# Altium schematic sheet CPLD.SchDoc: {Наименование}
size 420 x 297 mm; DocumentNumber: НРДЦ.ХХХХХХ.ХХХ ХХ; SheetNumber: {}; SheetTotal: {}; PageSetup: Record=PageOptions|CenterHorizontal=False|CenterVertical=False|PrintScale=0.95|XCorrection=0.00|YCorrection=0.00|PrintKind=1|BorderSize=5000000|LeftOffset=0|BottomOffset=0|Orientation=1|PaperLength=1000|PaperWidth=1000|Scale=100|PaperSource=15|PrintQuality=600|MediaType=1|DitherType=10|PaperKind=A4|PrintScaleMode=1; Rule: PcbType=ProtelPcb
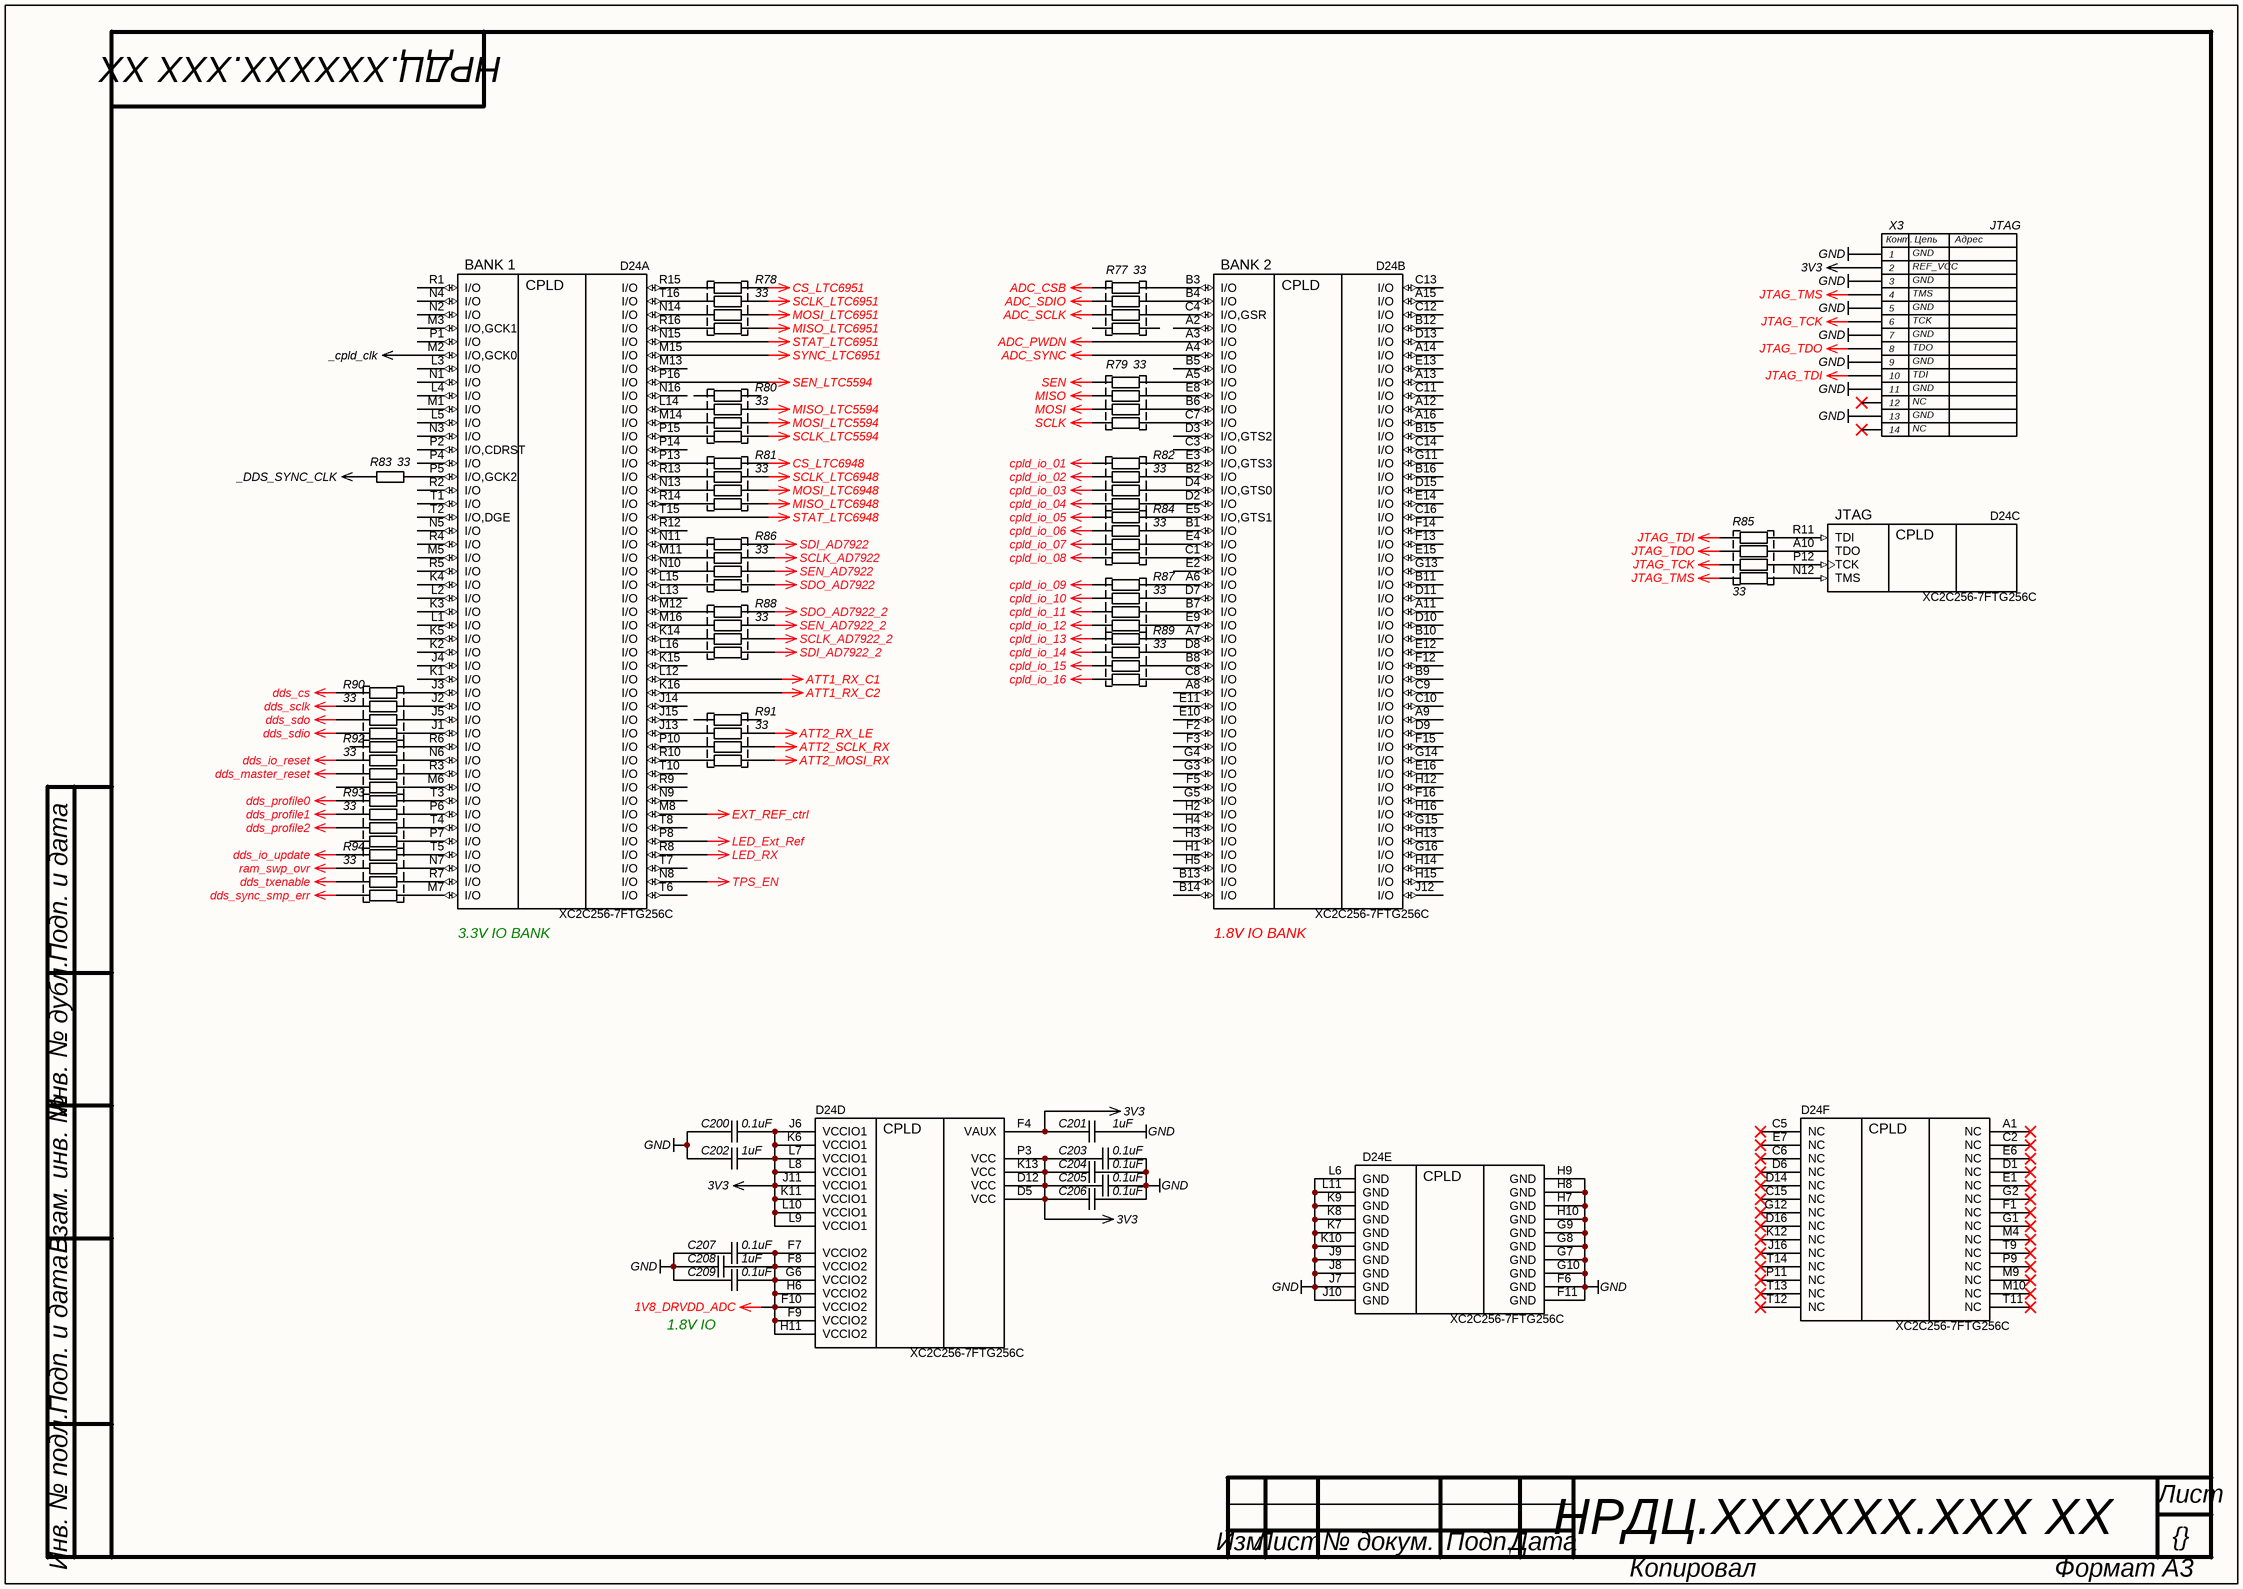
[diagram p0: CPLD.SchDoc]

## Parts
C200  value 0.1uF  [C0402]  (hidden comment: CAP)
C201  value 1uF  [C0402]  (hidden comment: CAP)
C202  value 1uF  [C0402]  (hidden comment: CAP)
C203  value 0.1uF  [C0402]  (hidden comment: CAP)
C204  value 0.1uF  [C0402]  (hidden comment: CAP)
C205  value 0.1uF  [C0402]  (hidden comment: CAP)
C206  value 0.1uF  [C0402]  (hidden comment: CAP)
C207  value 0.1uF  [C0402]  (hidden comment: CAP)
C208  value 1uF  [C0402]  (hidden comment: CAP)
C209  value 0.1uF  [C0402]  (hidden comment: CAP)
D24  XC2C256-7FTG256C  [FTG256]  (parts A,B,C,D,E,F of 6)
R77  value 33  [EXN8V]  (hidden comment: RES 4x0402)
R78  value 33  [EXN8V]  (hidden comment: RES 4x0402)
R79  value 33  [EXN8V]  (hidden comment: RES 4x0402)
R80  value 33  [EXN8V]  (hidden comment: RES 4x0402)
R81  value 33  [EXN8V]  (hidden comment: RES 4x0402)
R82  value 33  [EXN8V]  (hidden comment: RES 4x0402)
R83  value 33  [R0402]  (hidden comment: RES)
R84  value 33  [EXN8V]  (hidden comment: RES 4x0402)
R85  value 33  [EXN8V]  (hidden comment: RES 4x0402)
R86  value 33  [EXN8V]  (hidden comment: RES 4x0402)
R87  value 33  [EXN8V]  (hidden comment: RES 4x0402)
R88  value 33  [EXN8V]  (hidden comment: RES 4x0402)
R89  value 33  [EXN8V]  (hidden comment: RES 4x0402)
R90  value 33  [EXN8V]  (hidden comment: RES 4x0402)
R91  value 33  [EXN8V]  (hidden comment: RES 4x0402)
R92  value 33  [EXN8V]  (hidden comment: RES 4x0402)
R93  value 33  [EXN8V]  (hidden comment: RES 4x0402)
R94  value 33  [EXN8V]  (hidden comment: RES 4x0402)
X3  JTAG  [JTAG Mail 2mm]

## Nets
1V8_DRVDD_ADC: C207.2 C208.2 C209.2 D24.F7(VCCIO2) D24.F8(VCCIO2) D24.F9(VCCIO2) D24.F10(VCCIO2) D24.G6(VCCIO2) D24.H6(VCCIO2) D24.H11(VCCIO2)
3V3: C200.2 C201.1 C202.2 C203.1 C204.1 C205.1 C206.1 D24.D5(VCC) D24.D12(VCC) D24.F4(VAUX) D24.J6(VCCIO1) D24.J11(VCCIO1) D24.K6(VCCIO1) D24.K11(VCCIO1) D24.K13(VCC) D24.L7(VCCIO1) D24.L8(VCCIO1) D24.L9(VCCIO1) D24.L10(VCCIO1) D24.P3(VCC) X3.2
_cpld_clk: D24.M2(I/O,GCK0)
_DDS_SYNC_CLK: R83.1
ADC_CSB: R77.5
ADC_PWDN: D24.A3(I/O)
ADC_SCLK: R77.7
ADC_SDIO: R77.6
ADC_SYNC: D24.A4(I/O)
ATT1_RX_C1: D24.L12(I/O)
ATT1_RX_C2: D24.K16(I/O)
ATT2_MOSI_RX: R91.1
ATT2_RX_LE: R91.3
ATT2_SCLK_RX: R91.2
cpld_io_01: R82.5
cpld_io_02: R82.6
cpld_io_03: R82.7
cpld_io_04: R82.8
cpld_io_05: R84.5
cpld_io_06: R84.6
cpld_io_07: R84.7
cpld_io_08: R84.8
cpld_io_09: R87.5
cpld_io_10: R87.6
cpld_io_11: R87.7
cpld_io_12: R87.8
cpld_io_13: R89.5
cpld_io_14: R89.6
cpld_io_15: R89.7
cpld_io_16: R89.8
CS_LTC6948: R81.4
CS_LTC6951: R78.4
dds_cs: R90.5
dds_io_reset: R92.6
dds_io_update: R94.5
dds_master_reset: R92.7
dds_profile0: R93.5
dds_profile1: R93.6
dds_profile2: R93.7
dds_sclk: R90.6
dds_sdio: R90.8
dds_sdo: R90.7
dds_sync_smp_err: R94.8
dds_txenable: R94.7
EXT_REF_ctrl: D24.M8(I/O)
GND: C200.1 C201.2 C202.1 C203.2 C204.2 C205.2 C206.2 C207.1 C208.1 C209.1 D24.F6(GND) D24.F11(GND) D24.G7(GND) D24.G8(GND) D24.G9(GND) D24.G10(GND) D24.H7(GND) D24.H8(GND) D24.H9(GND) D24.H10(GND) D24.J7(GND) D24.J8(GND) D24.J9(GND) D24.J10(GND) D24.K7(GND) D24.K8(GND) D24.K9(GND) D24.K10(GND) D24.L6(GND) D24.L11(GND) X3.1 X3.3 X3.5 X3.7 X3.9 X3.11 X3.13
JTAG_TCK: R85.6 X3.6
JTAG_TDI: R85.8 X3.10
JTAG_TDO: R85.7 X3.8
JTAG_TMS: R85.5 X3.4
LED_Ext_Ref: D24.P8(I/O)
LED_RX: D24.R8(I/O)
MISO: R79.6
MISO_LTC5594: R80.3
MISO_LTC6948: R81.1
MISO_LTC6951: R78.1
MOSI: R79.7
MOSI_LTC5594: R80.2
MOSI_LTC6948: R81.2
MOSI_LTC6951: R78.2
ram_swp_ovr: R94.6
SCLK: R79.8
SCLK_AD7922: R86.3
SCLK_AD7922_2: R88.2
SCLK_LTC5594: R80.1
SCLK_LTC6948: R81.3
SCLK_LTC6951: R78.3
SDI_AD7922: R86.4
SDI_AD7922_2: R88.1
SDO_AD7922: R86.1
SDO_AD7922_2: R88.4
SEN: R79.5
SEN_AD7922: R86.2
SEN_AD7922_2: R88.3
SEN_LTC5594: D24.P16(I/O)
STAT_LTC6948: D24.T15(I/O)
STAT_LTC6951: D24.N15(I/O)
SYNC_LTC6951: D24.M15(I/O)
TPS_EN: D24.N8(I/O)
NetD24_A5: D24.A5(I/O) R79.4
NetD24_A6: D24.A6(I/O) R87.4
NetD24_A7: D24.A7(I/O) R89.4
NetD24_A10: D24.A10(TDO) R85.2
NetD24_B1: D24.B1(I/O) R84.3
NetD24_B2: D24.B2(I/O) R82.3
NetD24_B3: D24.B3(I/O) R77.4
NetD24_B4: D24.B4(I/O) R77.3
NetD24_B6: D24.B6(I/O) R79.2
NetD24_B7: D24.B7(I/O) R87.2
NetD24_B8: D24.B8(I/O) R89.2
NetD24_C1: D24.C1(I/O) R84.1
NetD24_C4: D24.C4(I/O,GSR) R77.2
NetD24_C7: D24.C7(I/O) R79.1
NetD24_C8: D24.C8(I/O) R89.1
NetD24_D2: D24.D2(I/O) R82.1
NetD24_D4: D24.D4(I/O,GTS0) R82.2
NetD24_D7: D24.D7(I/O) R87.3
NetD24_D8: D24.D8(I/O) R89.3
NetD24_E3: D24.E3(I/O,GTS3) R82.4
NetD24_E4: D24.E4(I/O) R84.2
NetD24_E5: D24.E5(I/O,GTS1) R84.4
NetD24_E8: D24.E8(I/O) R79.3
NetD24_E9: D24.E9(I/O) R87.1
NetD24_J1: D24.J1(I/O) R90.1
NetD24_J2: D24.J2(I/O) R90.3
NetD24_J3: D24.J3(I/O) R90.4
NetD24_J5: D24.J5(I/O) R90.2
NetD24_J13: D24.J13(I/O) R91.6
NetD24_K14: D24.K14(I/O) R88.7
NetD24_L14: D24.L14(I/O) R80.6
NetD24_L15: D24.L15(I/O) R86.8
NetD24_L16: D24.L16(I/O) R88.8
NetD24_M6: D24.M6(I/O) R92.1
NetD24_M7: D24.M7(I/O) R94.1
NetD24_M11: D24.M11(I/O) R86.6
NetD24_M12: D24.M12(I/O) R88.5
NetD24_M14: D24.M14(I/O) R80.7
NetD24_M16: D24.M16(I/O) R88.6
NetD24_N6: D24.N6(I/O) R92.3
NetD24_N7: D24.N7(I/O) R94.3
NetD24_N10: D24.N10(I/O) R86.7
NetD24_N11: D24.N11(I/O) R86.5
NetD24_N12: D24.N12(TMS) R85.4
NetD24_N13: D24.N13(I/O) R81.7
NetD24_N14: D24.N14(I/O) R78.7
NetD24_P5: D24.P5(I/O,GCK2) R83.2
NetD24_P6: D24.P6(I/O) R93.3
NetD24_P7: D24.P7(I/O) R93.1
NetD24_P10: D24.P10(I/O) R91.7
NetD24_P12: D24.P12(TCK) R85.3
NetD24_P13: D24.P13(I/O) R81.5
NetD24_P15: D24.P15(I/O) R80.8
NetD24_R3: D24.R3(I/O) R92.2
NetD24_R6: D24.R6(I/O) R92.4
NetD24_R7: D24.R7(I/O) R94.2
NetD24_R10: D24.R10(I/O) R91.8
NetD24_R11: D24.R11(TDI) R85.1
NetD24_R13: D24.R13(I/O) R81.6
NetD24_R14: D24.R14(I/O) R81.8
NetD24_R15: D24.R15(I/O) R78.5
NetD24_R16: D24.R16(I/O) R78.8
NetD24_T3: D24.T3(I/O) R93.4
NetD24_T4: D24.T4(I/O) R93.2
NetD24_T5: D24.T5(I/O) R94.4
NetD24_T16: D24.T16(I/O) R78.6

Not connected (* = marked no-connect by the designer): D24 A1(NC)* A2(I/O) A8(I/O) A9(I/O) A11(I/O) A12(I/O) A13(I/O) A14(I/O) A15(I/O) A16(I/O) B5(I/O) B9(I/O) B10(I/O) B11(I/O) B12(I/O) B13(I/O) B14(I/O) B15(I/O) B16(I/O) C2(NC)* C3(I/O) C5(NC)* C6(NC)* C9(I/O) C10(I/O) C11(I/O) C12(I/O) C13(I/O) C14(I/O) C15(NC)* C16(I/O) D1(NC)* D3(I/O,GTS2) D6(NC)* D9(I/O) D10(I/O) D11(I/O) D13(I/O) D14(NC)* D15(I/O) D16(NC)* E1(NC)* E2(I/O) E6(NC)* E7(NC)* E10(I/O) E11(I/O) E12(I/O) E13(I/O) E14(I/O) E15(I/O) E16(I/O) F1(NC)* F2(I/O) F3(I/O) F5(I/O) F12(I/O) F13(I/O) F14(I/O) F15(I/O) F16(I/O) G1(NC)* G2(NC)* G3(I/O) G4(I/O) G5(I/O) G11(I/O) G12(NC)* G13(I/O) G14(I/O) G15(I/O) G16(I/O) H1(I/O) H2(I/O) H3(I/O) H4(I/O) H5(I/O) H12(I/O) H13(I/O) H14(I/O) H15(I/O) H16(I/O) J4(I/O) J12(I/O) J14(I/O) J15(I/O) J16(NC)* K1(I/O) K2(I/O) K3(I/O) K4(I/O) K5(I/O) K12(NC)* K15(I/O) L1(I/O) L2(I/O) L3(I/O) L4(I/O) L5(I/O) L13(I/O) M1(I/O) M3(I/O,GCK1) M4(NC)* M5(I/O) M9(NC)* M10(NC)* M13(I/O) N1(I/O) N2(I/O) N3(I/O) N4(I/O) N5(I/O) N9(I/O) N16(I/O) P1(I/O) P2(I/O,CDRST) P4(I/O) P9(NC)* P11(NC)* P14(I/O) R1(I/O) R2(I/O) R4(I/O) R5(I/O) R9(I/O) R12(I/O) T1(I/O) T2(I/O,DGE) T6(I/O) T7(I/O) T8(I/O) T9(NC)* T10(I/O) T11(NC)* T12(NC)* T13(NC)* T14(NC)*; R77 1 8; R80 4 5; R91 4 5; R92 5 8; R93 8; X3 12* 14*

## Notes on the sheet
- (near X3) GND
- (near X3) REF_VCC
- (near X3) TMS
- (near X3) TCK
- (near X3) TDO
- (near X3) TDI
- (near X3) NC
- (near D24) 3.3V IO BANK
- (near D24) 1.8V IO BANK
- 1.8V IO
- Подп. и дата
- Инв. № дубл.
- Взам. инв. №
- Инв. № подл.
- Лист
- Изм.
- № докум.
- Подп.
- Дата
- Копировал
- Формат А3
- (in symbol HDR Debug_14-pin) Конт.; Цепь; Адрес
- (in symbol XC2C256-7FTG256C, part A) BANK 1
- (in symbol XC2C256-7FTG256C, part B) BANK 2
- (in symbol XC2C256-7FTG256C, part C) JTAG

## Library data of the parts
C200 C203-C207 C209 = CAP: SMD Capacitor; Manufacturer: Murata; Material: X7R; Tolerance: 10%; Voltage: 16V; Type: Ceramic Capacitor; P/N: GRM155R71C104KA88J
C201 C202 C208 = CAP: SMD Capacitor; Manufacturer: Murata; Material: X7R; Tolerance: 10%; Voltage: 6.3V; Type: Ceramic Capacitor; P/N: GRM155R70J105KA12J
D24 = XC2C256-7FTG256C: CoolRunner-II 1.8V, 256 Macrocell CPLD, 184 User I/Os, 256-Ball FTBGA, Commercial Grade, Pb-Free; Code_JEDEC: MS-034-AAF-1*; PackageVersion: ver1.3, Oct-2007; PackageReference: FTG256; PackageDescription: 256-Ball Fine Pitch Thin Ball Grid Array 1.00 mm Pitch (FTG256) - Pb-Free; DatasheetVersion: ver3.2, Mar-2007; PartNumber: XC2C256-7FTG256C; P/N: XC2C256-7FTG256C; Name: XC2C256-7FTG256C; Type: CPLD
R77-R82 R84-R94 = RES 4x0402: Chip Resistor Array; Manufacturer: Panasonic; Name: EXBN8V; Number of Resistors: 4; Tolerance: 5%; P/N: ERJ-2GEJ330X; Type: 0402 Array Concave Terminal; Number of Terminals: 8; Series: EXB
R83 = RES: SMD Resistor; Name: Chip SMD Resistor; Power: 0.062 Wt; Tolerance: 5%; P/N: ERJ-2GEJ330X; Temperature Range: -55…155°C
X3 = HDR Debug_14-pin: 2.00mm Pitch, Milli-Grid PCB Header, Dual Row, Vertical, Through Hole, Shrouded, 14 / Circuits; Manufacturer: Molex; Name: Milli-Grid Connector System; P/N: 878311421; Type: 2.00mm Pitch, Milli-Grid PCB Header, Dual Row, Vertical, Through Hole, Shrouded, 14; Series: 87831